# Altium schematic sheet cs301_3.SchDoc
size A4
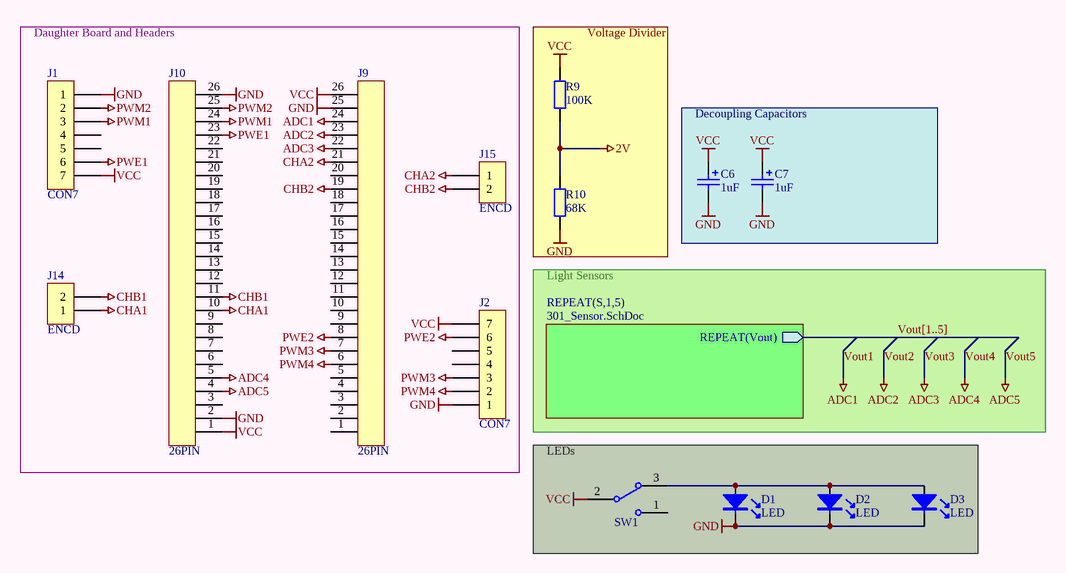
[diagram p0: cs301_3.SchDoc]

## Parts
C6  1uF  [ece-RAD-CAP--5X6.8]
C7  1uF  [ece-RAD-CAP--5X6.8]
D1  LED  [LED0.1/5MM]
D2  LED  [LED0.1/5MM]
D3  LED  [LED0.1/5MM]
J1  CON7  [SIP7]
J2  CON7  [SIP7]
J9  26PIN  [SIP26]
J10  26PIN  [SIP26]
J14  ENCD  [sip2]
J15  ENCD  [sip2]
R9  100K  [RESC2012-0805SM]
R10  68K  [RESC2012-0805SM]
SW1  SW  [ece-sw-SPDT]  (value not drawn)

## Blocks framed on the sheet
Daughter Board and Headers: J1 J2 J9 J10 J14 J15
Voltage Divider: R9 R10
Decoupling Capacitors: C6 C7
LEDs: D1-D3 SW1

## Sub-sheets
REPEAT(S,1,5) = 301_Sensor.SchDoc: REPEAT(Vout) (out)

## Nets
2V: R9.1 R10.2
CHA1: J10.10 J14.1
CHA2: J9.21 J15.1
CHB1: J10.11 J14.2
CHB2: J9.19 J15.2
GND: C6.2 C7.2 D1.K D2.K D3.K J1.1 J2.1 J9.25 J10.2 J10.26 R10.1
PWE1: J1.6 J10.23
PWE2: J2.6 J9.8
PWM1: J1.3 J10.24
PWM2: J1.2 J10.25
PWM3: J2.3 J9.7
PWM4: J2.2 J9.6
VCC: C6.1 C7.1 J1.7 J2.7 J9.26 J10.1 R9.2 SW1.2
Vout1: J9.24  [also labelled ADC1]
Vout2: J9.23  [also labelled ADC2]
Vout3: J9.22  [also labelled ADC3]
Vout4: J10.5  [also labelled ADC4]
Vout5: J10.4  [also labelled ADC5]
NetD1_A: D1.A D2.A D3.A SW1.3

Not connected (* = marked no-connect by the designer): J1 4 5; J2 4 5; J9 1 2 3 4 5 9 10 11 12 13 14 15 16 17 18 20; J10 3 6 7 8 9 12 13 14 15 16 17 18 19 20 21 22; SW1 1

## Buses and harness runs
bus Vout[1..5]

## Notes on the sheet
- Light Sensors

## Library data of the parts
C6 C7 = CAP 1-10uF TH: Polarized Capacitor (Radial); Manufacturer: Generic Components; Class I: Passive; Published: 8-Jun-2000; Revision: July-2002: Re-released for DXP Platform.; Publisher: Altium Limited; Class II: Capacitor; Value: 1uF
J1 J2 = CON7: Connector
J14 J15 = CON2: Connector
R9 R10 = Res SM 0805: SM resistor
  R9: Value: 100K
  R10: Value: 68K
SW1 = switch-SPDT: PCB mountabel switch